# EAGLE schematic SOIC-16 Breakout Board (EAGLE 8.4.1)
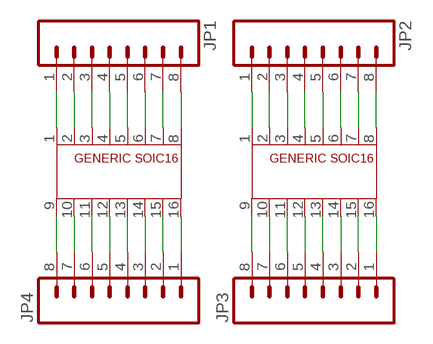
[diagram p0: schematic, sheet 1]

## Parts
JP1  M08  [1X08]
JP2  M08  [1X08]
JP3  M08  [1X08]
JP4  M08  [1X08]
U$1  SOIC16  [SOIC-16]
U$2  SOIC16  [SOIC-16]

## Nets
N$1: JP1.1 U$1.1
N$2: JP1.2 U$1.2
N$3: JP1.3 U$1.3
N$4: JP1.4 U$1.4
N$5: JP1.5 U$1.5
N$6: JP1.6 U$1.6
N$7: JP1.7 U$1.7
N$8: JP1.8 U$1.8
N$9: JP2.1 U$2.1
N$10: JP2.2 U$2.2
N$11: JP2.3 U$2.3
N$12: JP2.4 U$2.4
N$13: JP2.5 U$2.5
N$14: JP2.6 U$2.6
N$15: JP2.7 U$2.7
N$16: JP2.8 U$2.8
N$17: JP3.1 U$2.16
N$18: JP3.2 U$2.15
N$19: JP3.3 U$2.14
N$20: JP3.4 U$2.13
N$21: JP3.5 U$2.12
N$22: JP3.6 U$2.11
N$23: JP3.7 U$2.10
N$24: JP3.8 U$2.9
N$25: JP4.1 U$1.16
N$26: JP4.2 U$1.15
N$27: JP4.3 U$1.14
N$28: JP4.4 U$1.13
N$29: JP4.5 U$1.12
N$30: JP4.6 U$1.11
N$31: JP4.7 U$1.10
N$32: JP4.8 U$1.9

## Library data of the parts
JP1-JP4 = HyTechDevices:M08: Standard 8-pin 0.1" header. NOTES ON THE VARIANTS LOCK and LOCK_LONGPADS... This footprint was designed to help hold the alignment of a through-hole component (i.e. 6-pin header) while soldering it into place. You may notice that each hole has been shifted either up or down by 0.005 of an inch from it's more standard position (which is a perfectly straight line). This slight alteration caused the pins (the squares in the middle) to touch the edges of the holes. Because they are alternating, it causes a "brace" to hold the component in place. 0.005 has proven to be the perfect amount of "off-center" position when using our standard breakaway headers. Although looks a little odd when you look at the bare footprint, once you have a header in there, the alteration is very hard to notice. Also,if you push a header all the way into place, it is covered up entirely on the bottom side. This idea of altering the position of holes to aid alignment will be further integrated into the Sparkfun Library for other footprints. It can help hold any component with 3 or more connection pins. Note: The Sparkfun version includes many other packages including surface mount that may be of future interest. Source: Sparkfun <https://github.com/sparkfun/SparkFun-Eagle-Libraries>
U$1 U$2 = HyTechDevices:SOIC16